# Altium project VISION_BETA_EBB.PrjPcb (part 6 of 9)

## Sheet 5V_REG.SchDoc
size A4; SheetNumber: 12; SheetTotal: 19
Used 2 times, as channels REG_0, REG_1. Parts and nets are listed once, with the designators drawn on the sheet.
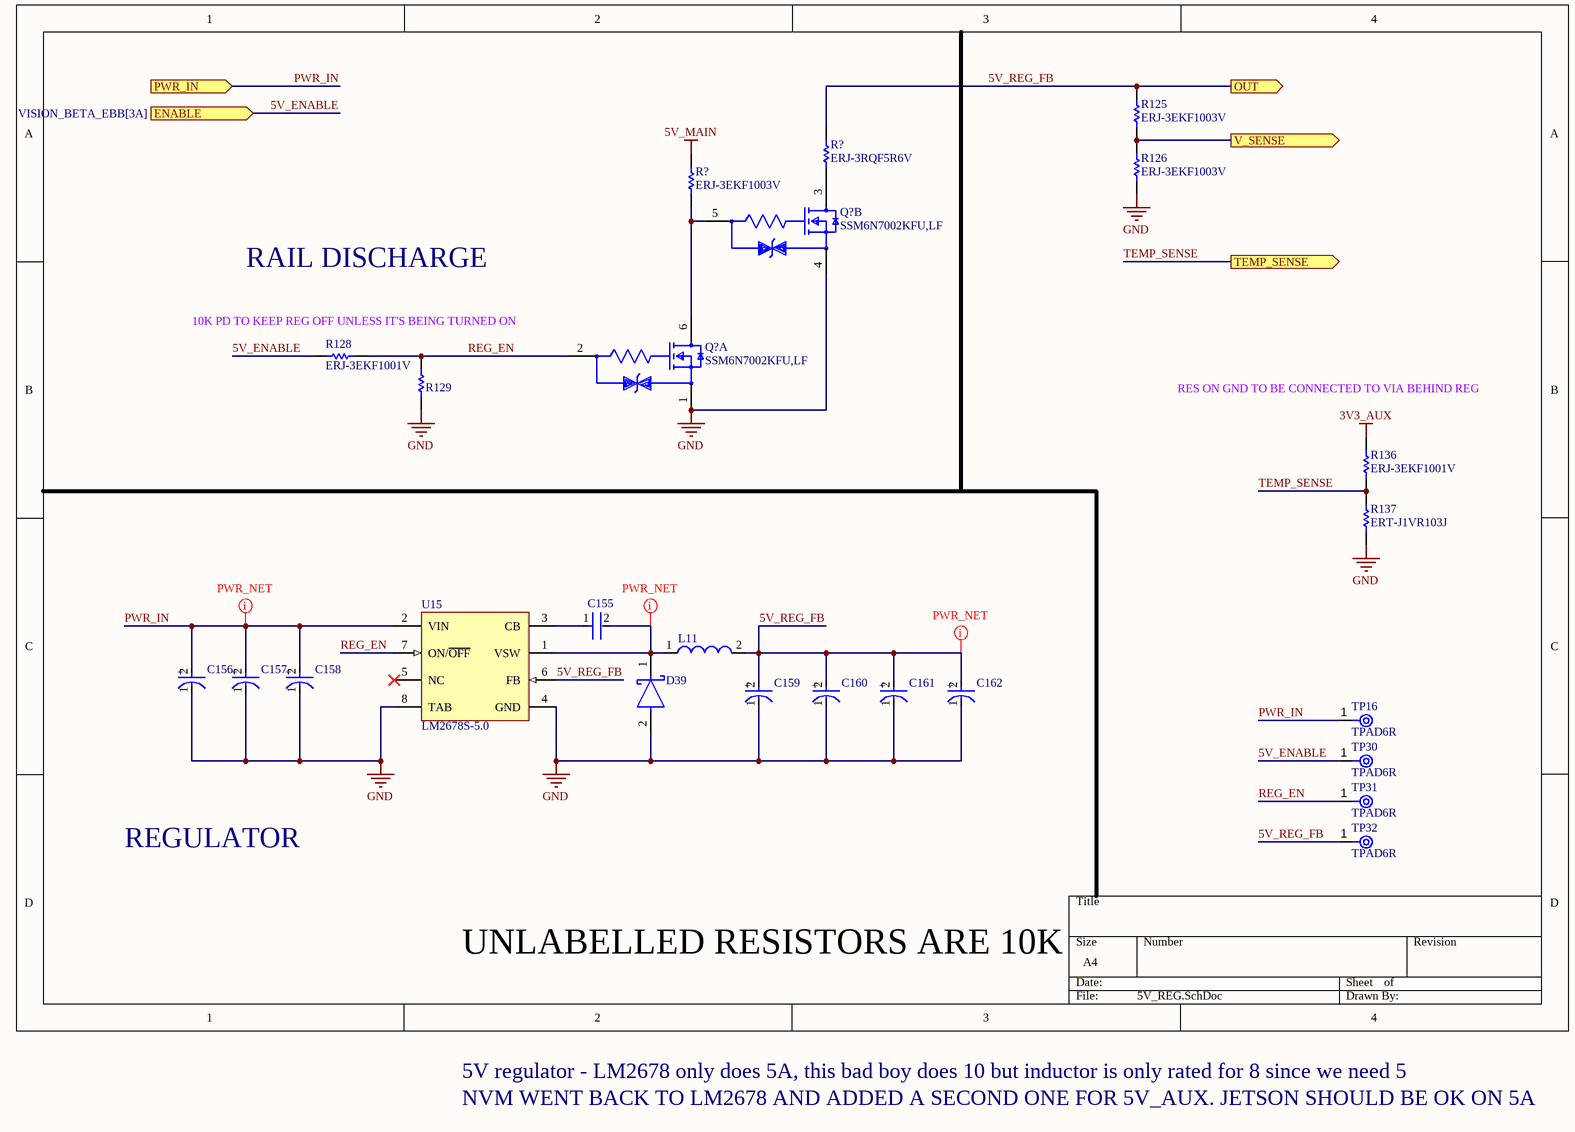
[diagram p30: 5V_REG.SchDoc]

### Parts
(Parts that share a designator on the sheet are numbered #1, #2 ... from top to bottom, then left to right.)
C155  C0805C103J5RACTU  [FP-C0805C-DN-MFG]  (value not drawn)
C156  20SVP33M  [FP-OS-CON-SMT-E7-MFG]  (value not drawn)
C157  20SVP33M  [FP-OS-CON-SMT-E7-MFG]  (value not drawn)
C158  20SVP33M  [FP-OS-CON-SMT-E7-MFG]  (value not drawn)
C159  EEE-1AA101WR  [FP-SC-MFG]  (value not drawn)
C160  EEE-1AA101WR  [FP-SC-MFG]  (value not drawn)
C161  EEE-1AA101WR  [FP-SC-MFG]  (value not drawn)
C162  EEE-1AA101WR  [FP-SC-MFG]  (value not drawn)
D39  B540C-13-F  [FP-SMC-MFG]  (value not drawn)
L11  74477110  [WE-PD-L]  (value not drawn)
Q?#1  SSM6N7002KFU,LF  [FP-SSOP6-P-0_65A-MFG]  (part B of 2)
Q?#2  SSM6N7002KFU,LF  [FP-SSOP6-P-0_65A-MFG]  (part A of 2)
R125  ERJ-3EKF1003V  [RESC1608X55X30ML15T15]
R126  ERJ-3EKF1003V  [RESC1608X55X30ML15T15]
R128  ERJ-3EKF1001V  [RESC1608X55X30LL15T15]
R129  ERJ3EKF1002V  [RESC1609X55X30LL15T15]  (value not drawn)
R136  ERJ-3EKF1001V  [RESC1608X55X30LL15T15]
R137  ERT-J1VR103J  [RESC1608X90X30ML15T20]
R?#1  ERJ-3RQF5R6V  [RESC1608X55X30LL15T15]
R?#2  ERJ-3EKF1003V  [RESC1608X55X30ML15T15]
TP16  TPAD6R  [New footprint 1]
TP30  TPAD6R  [New footprint 1]
TP31  TPAD6R  [New footprint 1]
TP32  TPAD6R  [New footprint 1]
U15  LM2678S-5.0  [KTW0007B_N]

### Ports
ENABLE (in, see VISION_BETA_EBB[3A]), OUT (out, see VISION_BETA_EBB[4A]), PWR_IN (in, see VISION_BETA_EBB[3A]), TEMP_SENSE (out, see VISION_BETA_EBB[4A]), V_SENSE (out, see VISION_BETA_EBB[4A])

### Nets
3V3_AUX: R136.2
5V_MAIN: R?#2.2
GND: C156.1(C) C157.1(C) C158.1(C) C159.1(C) C160.1(C) C161.1(C) C162.1(C) D39.2(A) Q?#1.4(Source2) Q?#2.1(Source1) R126.1 R129.1 R137.1 U15.4(GND) U15.8(TAB)
5V_ENABLE: R128.1 TP30.1(TP) ; port ENABLE
5V_REG_FB: C159.2(A) C160.2(A) C161.2(A) C162.2(A) L11.2 R125.2 R?#1.2 TP32.1(TP) U15.6(FB) ; port OUT
PWR_IN: C156.2(A) C157.2(A) C158.2(A) TP16.1(TP) U15.2(VIN) ; port PWR_IN
REG_EN: Q?#2.2(Gate1) R128.2 R129.2 TP31.1(TP) U15.7(ON/~{OFF})
TEMP_SENSE: R136.1 R137.2 ; port TEMP_SENSE
V_SENSE: R125.1 R126.2 ; port V_SENSE
NetC155_1: C155.1 U15.3(CB)
NetC155_2: C155.2 D39.1(C) L11.1 U15.1(VSW)
NetQ?#1_3: Q?#1.3(Drain2) R?#1.1
NetQ?#1_5: Q?#1.5(Gate2) Q?#2.6(Drain1) R?#2.1

Not connected (* = marked no-connect by the designer): U15 5(NC)*

### Channels
REG_0: designators C155=C155_REG_0 C156=C156_REG_0 C157=C157_REG_0 C158=C158_REG_0 C159=C159_REG_0 C160=C160_REG_0 C161=C161_REG_0 C162=C162_REG_0 D39=D39_REG_0 L11=L11_REG_0 Q?=Q?_REG_0#2 Q?=Q?_REG_0#1 R125=R125_REG_0 R126=R126_REG_0 R128=R128_REG_0 R129=R129_REG_0 R136=R136_REG_0 R137=R137_REG_0 R?=R?_REG_0#2 R?=R?_REG_0#1 TP16=TP16_REG_0 TP30=TP30_REG_0 TP31=TP31_REG_0 TP32=TP32_REG_0 U15=U15_REG_0; ports ENABLE=5V_ENABLE OUT=5V_REG_FB PWR_IN=5V_MAIN_VCC TEMP_SENSE=5V_MAIN_TEMP V_SENSE=5V_MAIN_V_SENSE
REG_1: designators C155=C155_REG_1 C156=C156_REG_1 C157=C157_REG_1 C158=C158_REG_1 C159=C159_REG_1 C160=C160_REG_1 C161=C161_REG_1 C162=C162_REG_1 D39=D39_REG_1 L11=L11_REG_1 Q?=Q?_REG_1#2 Q?=Q?_REG_1#1 R125=R125_REG_1 R126=R126_REG_1 R128=R128_REG_1 R129=R129_REG_1 R136=R136_REG_1 R137=R137_REG_1 R?=R?_REG_1#2 R?=R?_REG_1#1 TP16=TP16_REG_1 TP30=TP30_REG_1 TP31=TP31_REG_1 TP32=TP32_REG_1 U15=U15_REG_1; ports ENABLE=5V_AUX_ENABLE OUT=5V_REG_FB PWR_IN=INT_VCC TEMP_SENSE=5V_AUX_TEMP V_SENSE=5V_AUX_V_SENSE

### Layout directives
net class PWR: 5V_MAIN_VCC, 5V_REG_FB, NetC155_REG_0_2

### Notes on the sheet
- RAIL DISCHARGE
- 10K PD TO KEEP REG OFF UNLESS IT'S BEING TURNED ON
- RES ON GND TO BE CONNECTED TO VIA BEHIND REG
- REGULATOR
- UNLABELLED RESISTORS ARE 10K
- 5V regulator - LM2678 only does 5A, this bad boy does 10 but inductor is only rated for 8 since we need 5
- NVM WENT BACK TO LM2678 AND ADDED A SECOND ONE FOR 5V_AUX. JETSON SHOULD BE OK ON 5A
- (in symbol CMP-05427-000047-1) +
- (in symbol CMP-05428-001387-1) +

### Library data of the parts
C155 = CMP-2007-00254-2: CAP CER 10000PF 50V X7R 0805; Manufacturer: KEMET; Value: 10,000 pF; Material: Ceramic; Temperature Coefficient: 30ppm/°C; Tolerance: 0.05; Device Class L1: Passive Components; Temperature: -55°C to +125°C; Lead Free: Yes; ComponentLink2URL: https://content.kemet.com/datasheets/KEM_C1003_C0G_SMD.pdf; Device Class L3: Ceramic Capacitors; Temperature Characteristic: X7R; Temperature Range High: +125°C; Mouser Description: Capacitor; Ceramic; Cap 0.01uF; Tol 5%; Vol-Rtg 50 V; SMT; Case 0805; X7R; TR; ComponentLink2Description: Datasheet; Manufacturer Part Number: C0805C103J5RACTU; Height: 0.88mm; Digikey Description: CAP CER 10000PF 50V X7R 0805; Capacitance: 10,000 pF; Temperature Range Low: -55°C; Device Class L2: Capacitors; Octopart: https://octopart.com/c0805c103j5ractu-kemet-133473; Voltage Rating: 50 V; Category: Cap; RoHS: TRUE; Automotive: No; Package: C0805C-DN; Ipc Land Pattern Name: CAPC200125X78
C156-C158 = CMP-05428-001387-1: Conductive Polymer Aluminum Solid Capacitors (OS-CON) 33uF ±20% 20V RADIAL SMT 8x6.9mm; Polarity: Polar; Life (Hours): 2000Hour; Leakage Current: 132uA; ESR (Equivalent Series Resistance): 45mR; Ripple Current (AC): 1.89A; Dissipation Factor: 12%; Construction: Cylindrical; Capacitance: 33uF; Max Operating Temperature: 105°C; Min Operating Temperature: -55°C; Voltage: 20V; Number of Pins: 7; Termination: SMD/SMT; Package Quantity: 1000; Packaging: Tape and Reel; REACH SVHC: No SVHC; Mount: Surface Mount; Tolerance: 20%; Voltage Rating (DC): 20V; Height: 6.9mm; Series: OS-CON™, SVP; Diameter: 8mm; Length: 6.9mm; Ripple Current: 1.89A; RoHS Compliant: Yes; Height - Seated (Max): 0.276inch; Case/Package: Radial; Voltage Rating: 20V
C159-C162 = CMP-05427-000047-1: CAP ALUM 100UF 20% 10V SMD; Life (Hours): 1000Hour; Ripple Current: 50mA; Packaging: Tape and Reel; Diameter: 5mm; Voltage Rating (DC): 10V; Mount: Surface Mount; Max Operating Temperature: 85°C; Length: 5.5mm; Case/Package: Radial; Height: 5.4mm; Construction: Cylindrical; Termination: SMD/SMT; Height - Seated (Max): 0.213inch; Series: S; Min Operating Temperature: -40°C; Capacitance: 100uF; Tolerance: 20%; Voltage Rating: 10V; Package Quantity: 1; Radiation Hardening: No; Ripple Current (AC): 50mA; Lead Free: Lead Free; RoHS Compliant: Yes; Contact Plating: Tin
D39 = CMP-2000-05097-3: DIODE SCHOTTKY 40V 5A SMC; Manufacturer: Diodes Inc.; Automotive Grade: NA; Peak Reverse Current: 0.5mA; Value: 300pF; Max Junction Temp: +150°C; Max Surge Forward Current: 100A; Standoff Height: 0.1mm; Digikey Description: DIODE SCHOTTKY 40V 5A SMC; Temperature Range Low: -55°C; Manufacturer Part Number: B540C-13-F; Octopart: https://octopart.com/b540c-13-f-diodes+inc.-325873; Lead Free: Yes; Reverse Voltage: 40V; RoHS: TRUE; Category: Diode; Mouser Description: Diode: Schottky rectifying; SMD; 40V; 5A; SMC; Package: reel, tape; ComponentLink2Description: Datasheet; Temperature Range High: +150°C; Automotive: No; Footprint Url: https://www.diodes.com/assets/Package-Files/SMC.pdf; Device Class L3: Schottky Diodes; Height: 2.5mm; Forward Current: 5A; Temperature: -55°C to +150°C; Package: SMC; ComponentLink2URL: https://www.diodes.com/assets/Datasheets/ds13012.pdf; Device Class L2: Diodes; Max Repetitive Reverse Voltage: 40V; Device Class L1: Discrete Semiconductors; Capacitance: 300pF
L11 = CMP-0227-00708-1: SMD-Shielded Power Inductor WE-PD, L = 10.0 µH; Inductance: 10.0 ÂµH; ComponentLink2Description: Datasheet; DatasheetVersion: ver 7, Sep-2006; PackageVersion: 2006; ComponentLink1URL: http://www.we-online.com; ComponentLink1Description: Manufacturer Link; ComponentLink2URL: http://www.we-online.de/katalog/media/pdf/74477110.pdf; PackageDescription: SMD Inductor, 2-Leads, Body 12.0 x 12.0 mm; PackageReference: WE-PD-L
Q?#1 Q?#2 = CMP-35916-000009-1: MOSFET 2N-CH 60V 0.3A; Input Capacitance: 40pF; Continuous Drain Current (ID): 300mA; Max Power Dissipation: 285mW; FET Type: 2 N-Channel; Rds On Max: 1.5R; Mount: Surface Mount; Drain to Source Voltage (Vdss): 60V; Packaging: Tape and Reel
R125 R126 R?#2 = CMP-2000-00182-1: Manufacturer: Panasonic; Part Number: ERJ-3EKF1003V
R128 R136 = CMP-2000-00180-1: Manufacturer: Panasonic; Part Number: ERJ-3EKF1001V
R129 = CMP-1012-00623-3: Chip Resistor, 10 KOhm, +/- 1%, 0.1 W, -55 to 155 degC, 0603 (1608 Metric), RoHS, Tape and Reel; Manufacturer: Panasonic; Voltage Rating: 75V; Case\/Package: 0603; Power Rating: 100mW; Resistance: 10KOhm; Temperature Coefficient: 100ppm\/degreesC; Number of Pins: 2; Package Reference: 603; Depth: 0.8mm; Mount: SurfaceMount; Package Description: 2-Pin Surface Mount Device, Body 1.6 x 0.85 mm; Datasheet Version: 02/2017; Length: 1.6mm; Lead Free: LeadFree; Height: 0.45mm; Number of Terminations: 2; Max Power Dissipation: 100mW; Min Operating Temperature: -55degC; Datasheet URL: https://industrial.panasonic.com/cdbs/www-data/pdf/RDA0000/AOA0000C304.pdf; Termination: SMD/SMT; Case Code (Metric): 1608; Case Code (Imperial): 0603; Tolerance: 1%; Max Operating Temperature: 155degC; RoHSCompliant: true; Voltage Rating (DC): 75V; Radiation Hardening: No; Packaging: TapeandReel; Composition: ThickFilm; Mounting Technology: SurfaceMount; Manufacturer URL: http://www.panasonic.com/; Width: 0.031inch; REACH SVHC: NoSVHC; Contact Plating: Tin; Military Standard: Not; Package Quantity: 1
R137 = CMP-2000-00869-1: Manufacturer: Panasonic; Part Number: ERT-J1VR103J
R?#1 = CMP-2000-00850-1: Manufacturer: Panasonic; Part Number: ERJ-3RQF5R6V
TP16 TP30-TP32 = CMP-00025-2: Test Point .6mm
U15 = CMP-0069-00190-3: SIMPLE SWITCHER® High Efficiency 5A Step-Down Voltage Regulator, 7-pin TO-263; Manufacturer: Texas Instruments; PowerWise: N; PackageTopMarking: NSUZXYTTE#*LM2678*S-5.0; RoHS: N; PinCount: 7; Code_JEDEC: MO-169-AC; ComponentLink1URL: http://www.ti.com/general/docs/lit/getliterature.tsp?genericPartNumber=LM2678&fileType=pdf; ComponentLink1Description: Datasheet URL; PackageReference: KTW0007B; PackageDescription: TO-263, Molded, .400 x .390 x .180in Body, 7 Lead, .050in Pitch, Surface Mount; CompType: Switcher

## Sheet 2V_REG.SchDoc
size A4; SheetNumber: 10; SheetTotal: 19
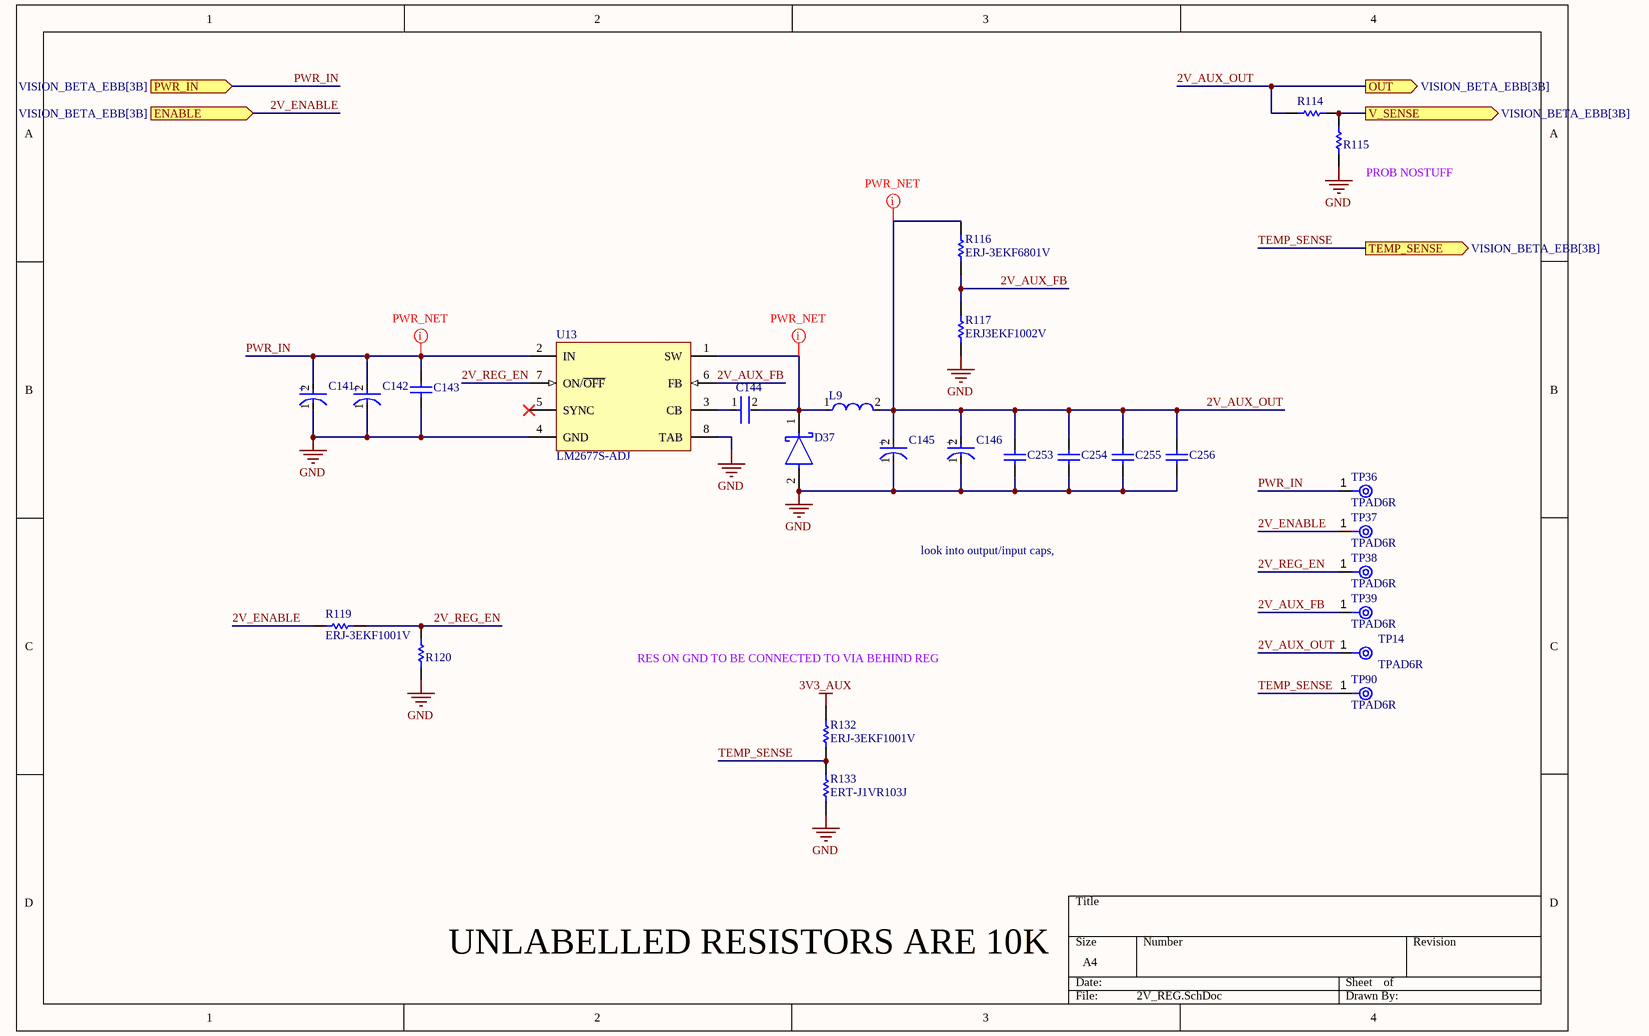
[diagram p31: 2V_REG.SchDoc]

### Parts
C141  EEHZA1V680XP  [FP-EEH-D8-MFG]  (value not drawn)
C142  EEHZA1V680XP  [FP-EEH-D8-MFG]  (value not drawn)
C143  CAP 470nF 50V 1812(4532)  [CAPC1812(4532)125_M]  (value not drawn)
C144  C0805C103J5RACTU  [FP-C0805C-DN-MFG]  (value not drawn)
C145  16SVPC120M  [FP-OS-CON-SMT-E7-MFG]  (value not drawn)
C146  16SVPC120M  [FP-OS-CON-SMT-E7-MFG]  (value not drawn)
C253  CAP 470nF 50V 1812(4532)  [CAPC1812(4532)125_M]  (value not drawn)
C254  CAP 470nF 50V 1812(4532)  [CAPC1812(4532)125_M]  (value not drawn)
C255  CAP 470nF 50V 1812(4532)  [CAPC1812(4532)125_M]  (value not drawn)
C256  CAP 470nF 50V 1812(4532)  [CAPC1812(4532)125_M]  (value not drawn)
D37  B540C-13-F  [FP-SMC-MFG]  (value not drawn)
L9  SRR1260-150M  [FP-SRR1260-MFG]  (value not drawn)
R114  ERJ3EKF1002V  [RESC1609X55X30LL15T15]  (value not drawn)
R115  ERJ3EKF1002V  [RESC1609X55X30LL15T15]  (value not drawn)
R116  ERJ-3EKF6801V  [RESC1609X55X30NL15T15]
R117  ERJ3EKF1002V  [RESC1609X55X30LL15T15]
R119  ERJ-3EKF1001V  [RESC1608X55X30LL15T15]
R120  ERJ3EKF1002V  [RESC1609X55X30LL15T15]  (value not drawn)
R132  ERJ-3EKF1001V  [RESC1608X55X30LL15T15]
R133  ERT-J1VR103J  [RESC1608X90X30ML15T20]
TP14  TPAD6R  [New footprint 1]
TP36  TPAD6R  [New footprint 1]
TP37  TPAD6R  [New footprint 1]
TP38  TPAD6R  [New footprint 1]
TP39  TPAD6R  [New footprint 1]
TP90  TPAD6R  [New footprint 1]
U13  LM2677S-ADJ  [KTW0007B_M]

### Ports
ENABLE (in, see VISION_BETA_EBB[3B]), OUT (out, see VISION_BETA_EBB[3B]), PWR_IN (in, see VISION_BETA_EBB[3B]), TEMP_SENSE (out, see VISION_BETA_EBB[3B]), V_SENSE (out, see VISION_BETA_EBB[3B])

### Nets
2V_AUX_OUT: C145.2(A) C146.2(A) C253.2 C254.2 C255.2 C256.2 L9.2 R114.1 R116.2 TP14.1(TP) ; port OUT
3V3_AUX: R132.2  [project net 3V3_AUX_FB]
GND: C141.1(C) C142.1(C) C143.1 C145.1(C) C146.1(C) C253.1 C254.1 C255.1 C256.1 D37.2(A) R115.1 R117.1 R120.1 R133.1 U13.4(GND) U13.8(TAB)
2V_AUX_FB: R116.1 R117.2 TP39.1(TP) U13.6(FB)
2V_AUX_V_SENSE: R114.2 R115.2 ; port V_SENSE
2V_ENABLE: R119.1 TP37.1(TP) ; port ENABLE  [project net 2V_AUX_ENABLE]
2V_REG_EN: R119.2 R120.2 TP38.1(TP) U13.7(ON/~{OFF})
PWR_IN: C141.2(A) C142.2(A) C143.2 TP36.1(TP) U13.2(IN) ; port PWR_IN  [project net 2V_AUX_VCC]
TEMP_SENSE: R132.1 R133.2 TP90.1(TP) ; port TEMP_SENSE  [project net 2V_AUX_TEMP]
NetC144_1: C144.1 U13.3(CB)
NetC144_2: C144.2 D37.1(C) L9.1 U13.1(SW)

Not connected (* = marked no-connect by the designer): U13 5(SYNC)*

### Layout directives
net class PWR: 2V_AUX_OUT, 2V_AUX_VCC, NetC144_2

### Notes on the sheet
- (near R115) PROB NOSTUFF
- look into output/input caps,
- RES ON GND TO BE CONNECTED TO VIA BEHIND REG
- UNLABELLED RESISTORS ARE 10K
- (in symbol CMP-05428-000021-2) +
- (in symbol CMP-05428-001211-1) +

### Library data of the parts
C141 C142 = CMP-05428-001211-1: Conductive Polymer Hybrid Aluminum Electrolytic Capacitors 68uF ±20% 35V RADIAL SMT 6.3x7.7mm; Leakage Current: 23.8uA; Ripple Current (AC): 2A; Polarity: Polar; Life (Hours): 5000Hour; ESR (Equivalent Series Resistance): 35mR; Lead Diameter: 0.65mm; Termination: SMD/SMT; Case/Package: Radial; Package Quantity: 900; Radiation Hardening: No; Max Operating Temperature: 105°C; Capacitance: 68uF; Voltage Rating: 35V; Number of Pins: 8; Mount: Surface Mount; Technology: HYBRID; Diameter: 6.3mm; Min Operating Temperature: -55°C; Length: 7.7mm; Ratings: AEC-Q200; Height - Seated (Max): 0.315inch; Ripple Current: 2A; Lead Free: Lead Free; Voltage: 35V; Lead Pitch: 1.8mm; Voltage Rating (DC): 35V; REACH SVHC: No SVHC; Material: Polymer; Height: 7.7mm; Tolerance: 20%; Construction: Cylindrical; Packaging: Tape and Reel; Series: ZA
C143 C253-C256 = CMP-1040-01539-1: CAP 470nF 50V ±10% 1812 (4532 Metric) Thickness 1.25mm SMD; Tolerance: Â±10%; Case-Metric: 4532; Case-EIA: 1812; Technology: SMT; Max Thickness: 1.25 mm; Value: 470nF; Rated Voltage: 50 V
C144 = CMP-2007-00254-2: as C155 on sheet 5V_REG; Device Class L1: Passive Components; Temperature: -55°C to +125°C; Lead Free: Yes; ComponentLink2URL: https://content.kemet.com/datasheets/KEM_C1003_C0G_SMD.pdf; Device Class L3: Ceramic Capacitors; Temperature Characteristic: X7R; Temperature Range High: +125°C; Mouser Description: Capacitor; Ceramic; Cap 0.01uF; Tol 5%; Vol-Rtg 50 V; SMT; Case 0805; X7R; TR; ComponentLink2Description: Datasheet; Manufacturer Part Number: C0805C103J5RACTU; Height: 0.88mm; Digikey Description: CAP CER 10000PF 50V X7R 0805; Capacitance: 10,000 pF; Temperature Range Low: -55°C; Device Class L2: Capacitors; Octopart: https://octopart.com/c0805c103j5ractu-kemet-133473; Voltage Rating: 50 V; Category: Cap; RoHS: TRUE; Automotive: No; Package: C0805C-DN; Ipc Land Pattern Name: CAPC200125X78
C145 C146 = CMP-05428-000021-2: Conductive Polymer Aluminum Solid Capacitors (OS-CON) 120uF ±20% 16V RADIAL SMT 8x6.9mm; Leakage Current: 500uA; Ripple Current: 2.9A; ESR (Equivalent Series Resistance): 27mR; Polarity: Polar; Dissipation Factor: 12%; Life (Hours): 2000Hour; Lead Free: Lead Free; Voltage Rating (DC): 16V; Min Operating Temperature: -55°C; Height - Seated (Max): 0.276inch; Case/Package: Radial; REACH SVHC: No SVHC; Diameter: 8mm; Mount: Surface Mount; Package Quantity: 1000; Construction: Cylindrical; Max Operating Temperature: 105°C; Capacitance: 120uF; Voltage: 16V; Length: 6.9mm; Tolerance: 20%; RoHS Compliant: Yes; Series: OS-CON, SVPC; Packaging: Tape and Reel; Voltage Rating: 16V; Termination: SMD/SMT; Number of Pins: 7; Ripple Current (AC): 2.9A; Height: 6.9mm
D37 = CMP-2000-05097-3: as D39 on sheet 5V_REG; Digikey Description: DIODE SCHOTTKY 40V 5A SMC; Temperature Range Low: -55°C; Manufacturer Part Number: B540C-13-F; Octopart: https://octopart.com/b540c-13-f-diodes+inc.-325873; Lead Free: Yes; Reverse Voltage: 40V; RoHS: TRUE; Category: Diode; Mouser Description: Diode: Schottky rectifying; SMD; 40V; 5A; SMC; Package: reel, tape; ComponentLink2Description: Datasheet; Temperature Range High: +150°C; Automotive: No; Footprint Url: https://www.diodes.com/assets/Package-Files/SMC.pdf; Device Class L3: Schottky Diodes; Height: 2.5mm; Forward Current: 5A; Temperature: -55°C to +150°C; Package: SMC; ComponentLink2URL: https://www.diodes.com/assets/Datasheets/ds13012.pdf; Device Class L2: Diodes; Max Repetitive Reverse Voltage: 40V; Device Class L1: Discrete Semiconductors; Capacitance: 300pF
L9 = CMP-2000-07146-2: FIXED IND 15UH 5A 27 MOHM SMD; Q Factor: 25; Sample Rate (Hz): 100kHz; Resistance: 27MR; Material: Steel; Inductance Tolerance: 20%; Frequency: 17.6MHz; Saturation Current: 4.6A; Core Material: Ferrite; Shielding: Shielded; Series: SRR1260; Termination: SMD/SMT; Packaging: Tape and Reel; RoHS Compliant: Yes; Height - Seated (Max): 0.256inch; Depth: 12.8mm; Case/Package: 1260; Inductance: 15uH; Height: 6mm; Number of Pins: 2; Mount: Surface Mount; Min Operating Temperature: -40°C; Test Frequency: 100kHz; Length: 12.5mm; Self Resonant Frequency: 17.6MHz; Current Rating: 5A; Tolerance: 20%; RMS Current (Irms): 5A; REACH SVHC: No SVHC; Resistor Type: Wirewound; DC Resistance (DCR): 27mR; Width: 12.5mm; Package Quantity: 600; DC Current: 5A; Max DC Current: 5A; Max Operating Temperature: 125°C; Military Standard: Not
R114 R115 R117 R120 = CMP-1012-00623-3: as R129 on sheet 5V_REG; Number of Pins: 2; Package Reference: 603; Depth: 0.8mm; Mount: SurfaceMount; Package Description: 2-Pin Surface Mount Device, Body 1.6 x 0.85 mm; Datasheet Version: 02/2017; Length: 1.6mm; Lead Free: LeadFree; Height: 0.45mm; Number of Terminations: 2; Max Power Dissipation: 100mW; Min Operating Temperature: -55degC; Datasheet URL: https://industrial.panasonic.com/cdbs/www-data/pdf/RDA0000/AOA0000C304.pdf; Termination: SMD/SMT; Case Code (Metric): 1608; Case Code (Imperial): 0603; Tolerance: 1%; Max Operating Temperature: 155degC; RoHSCompliant: true; Voltage Rating (DC): 75V; Radiation Hardening: No; Packaging: TapeandReel; Composition: ThickFilm; Mounting Technology: SurfaceMount; Manufacturer URL: http://www.panasonic.com/; Width: 0.031inch; REACH SVHC: NoSVHC; Contact Plating: Tin; Military Standard: Not; Package Quantity: 1
R116 = CMP-1012-00604-3: Chip Resistor, 6.8 KOhm, +/- 1%, 0.1 W, -55 to 155 degC, 0603 (1608 Metric), RoHS, Tape and Reel; Frequency: 48 MHz; Min Supply Voltage: 1.71 V; I\Os: 50; Max Supply Voltage: 3.6 V; Interface: UART; Density: 128 KB; RAM Size: 16 KB; PWM Channels: 6; ADC Channels: 14; Case\Package: LQFP; PackageDescription: 2-Pin Surface Mount Device, Body 1.6 x 0.85 mm; Max Operating Temperature: 105 degC; Package Quantity: 160; ComponentLink2Description: Datasheet; Max Clock Frequency: 48 MHz; ComponentLink1URL: http://www.panasonic.com/; REACH SVHC: No SVHC; Min Operating Temperature: -40 degC; Weight: 0.012224 oz; ComponentLink2URL: http://industrial.panasonic.com/cdbs/www-data/pdf/RDA0000/AOA0000C86.pdf; ComponentLink1Description: Manufacturer URL; Pins: 64; DatasheetVersion: Apr-15; RoHSCompliant: true; PackageReference: 0603; Packaging: Tray; Length: 10 mm; Radiation Hardening: No; Mount: Surface Mount; Width: 10 mm; Height: 1.45 mm
R119 R132 = CMP-2000-00180-1: Manufacturer: Panasonic; Part Number: ERJ-3EKF1001V
R133 = CMP-2000-00869-1: Manufacturer: Panasonic; Part Number: ERT-J1VR103J
TP14 TP36-TP39 TP90 = CMP-00025-2: Test Point .6mm
U13 = CMP-0069-00211-3: SIMPLE SWITCHER® High Efficiency 5A Step-Down Voltage Regulator with Sync, 7-pin TO-263; Manufacturer: Texas Instruments; PackageTopMarking: NSUZXYTTE#*LM2677S*-ADJ; PowerWise: N; PinCount: 7; CompType: Switcher; ComponentLink1Description: Datasheet URL; PackageReference: KTW0007B; Code_JEDEC: MO-169-AC; ComponentLink1URL: http://www.ti.com/general/docs/lit/getliterature.tsp?genericPartNumber=LM2677&fileType=pdf; PackageDescription: TO-263, Molded, .400 x .390 x .180in Body, 7 Lead, .050in Pitch, Surface Mount; RoHS: N

## Sheet 3V3_REG.SchDoc
size A4; SheetNumber: 11; SheetTotal: 18
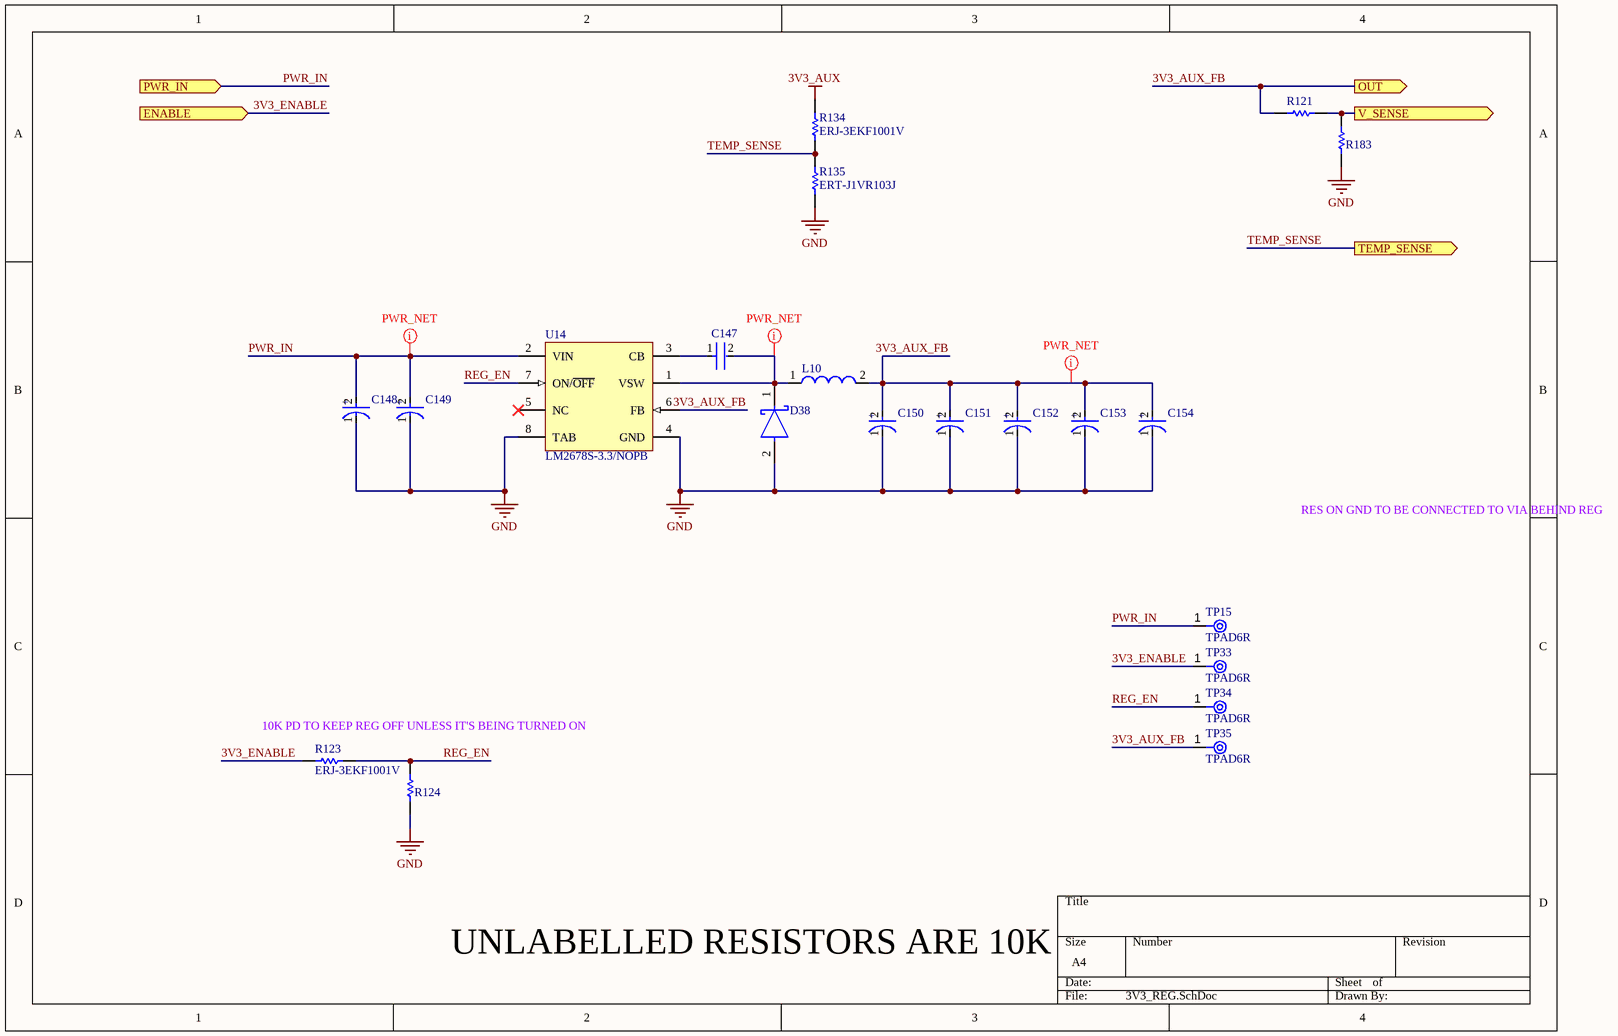
[diagram p32: 3V3_REG.SchDoc]

### Parts
C147  C0805C103J5RACTU  [FP-C0805C-DN-MFG]  (value not drawn)
C148  EEHZA1V680XP  [FP-EEH-D8-MFG]  (value not drawn)
C149  EEHZA1V680XP  [FP-EEH-D8-MFG]  (value not drawn)
C150  16SVPC120M  [FP-OS-CON-SMT-E7-MFG]  (value not drawn)
C151  16SVPC120M  [FP-OS-CON-SMT-E7-MFG]  (value not drawn)
C152  16SVPC120M  [FP-OS-CON-SMT-E7-MFG]  (value not drawn)
C153  16SVPC120M  [FP-OS-CON-SMT-E7-MFG]  (value not drawn)
C154  16SVPC120M  [FP-OS-CON-SMT-E7-MFG]  (value not drawn)
D38  B540C-13-F  [FP-SMC-MFG]  (value not drawn)
L10  74477110  [WE-PD-L]  (value not drawn)
R121  ERJ3EKF1002V  [RESC1609X55X30LL15T15]  (value not drawn)
R123  ERJ-3EKF1001V  [RESC1608X55X30LL15T15]
R124  ERJ3EKF1002V  [RESC1609X55X30LL15T15]  (value not drawn)
R134  ERJ-3EKF1001V  [RESC1608X55X30LL15T15]
R135  ERT-J1VR103J  [RESC1608X90X30ML15T20]
R183  ERJ3EKF1002V  [RESC1609X55X30LL15T15]  (value not drawn)
TP15  TPAD6R  [New footprint 1]
TP33  TPAD6R  [New footprint 1]
TP34  TPAD6R  [New footprint 1]
TP35  TPAD6R  [New footprint 1]
U14  LM2678S-3.3/NOPB  [KTW0007B_N]

### Ports
ENABLE (in), OUT (out, see VISION_BETA_EBB[4A]), PWR_IN (in, see VISION_BETA_EBB[3A]), TEMP_SENSE (out, see VISION_BETA_EBB[4A]), V_SENSE (out, see VISION_BETA_EBB[4A])

### Nets
3V3_AUX_FB: C150.2(A) C151.2(A) C152.2(A) C153.2(A) C154.2(A) L10.2 R121.1 R134.2 TP35.1(TP) U14.6(FB) ; port OUT  [also labelled 3V3_AUX]
GND: C148.1(C) C149.1(C) C150.1(C) C151.1(C) C152.1(C) C153.1(C) C154.1(C) D38.2(A) R124.1 R135.1 R183.1 U14.4(GND) U14.8(TAB)
3V3_AUX_V_SENSE: R121.2 R183.2 ; port V_SENSE
3V3_ENABLE: R123.1 TP33.1(TP) ; port ENABLE  [project net 3V3_AUX_ENABLE]
PWR_IN: C148.2(A) C149.2(A) TP15.1(TP) U14.2(VIN) ; port PWR_IN  [project net 3V3_AUX_VCC]
REG_EN: R123.2 R124.2 TP34.1(TP) U14.7(ON/~{OFF})
TEMP_SENSE: R134.1 R135.2 ; port TEMP_SENSE  [project net 3V3_AUX_TEMP]
NetC147_1: C147.1 U14.3(CB)
NetC147_2: C147.2 D38.1(C) L10.1 U14.1(VSW)

Not connected (* = marked no-connect by the designer): U14 5(NC)*

### Layout directives
net class PWR: 3V3_AUX_FB, 3V3_AUX_VCC, NetC147_2

### Notes on the sheet
- RES ON GND TO BE CONNECTED TO VIA BEHIND REG
- 10K PD TO KEEP REG OFF UNLESS IT'S BEING TURNED ON
- UNLABELLED RESISTORS ARE 10K
- (in symbol CMP-05428-000021-2) +
- (in symbol CMP-05428-001211-1) +

### Library data of the parts
C147 = CMP-2007-00254-2: as C155 on sheet 5V_REG; Device Class L1: Passive Components; Temperature: -55°C to +125°C; Lead Free: Yes; ComponentLink2URL: https://content.kemet.com/datasheets/KEM_C1003_C0G_SMD.pdf; Device Class L3: Ceramic Capacitors; Temperature Characteristic: X7R; Temperature Range High: +125°C; Mouser Description: Capacitor; Ceramic; Cap 0.01uF; Tol 5%; Vol-Rtg 50 V; SMT; Case 0805; X7R; TR; ComponentLink2Description: Datasheet; Manufacturer Part Number: C0805C103J5RACTU; Height: 0.88mm; Digikey Description: CAP CER 10000PF 50V X7R 0805; Capacitance: 10,000 pF; Temperature Range Low: -55°C; Device Class L2: Capacitors; Octopart: https://octopart.com/c0805c103j5ractu-kemet-133473; Voltage Rating: 50 V; Category: Cap; RoHS: TRUE; Automotive: No; Package: C0805C-DN; Ipc Land Pattern Name: CAPC200125X78
C148 C149 = CMP-05428-001211-1: as C141 on sheet 2V_REG; Termination: SMD/SMT; Case/Package: Radial; Package Quantity: 900; Radiation Hardening: No; Max Operating Temperature: 105°C; Capacitance: 68uF; Voltage Rating: 35V; Number of Pins: 8; Mount: Surface Mount; Technology: HYBRID; Diameter: 6.3mm; Min Operating Temperature: -55°C; Length: 7.7mm; Ratings: AEC-Q200; Height - Seated (Max): 0.315inch; Ripple Current: 2A; Lead Free: Lead Free; Voltage: 35V; Lead Pitch: 1.8mm; Voltage Rating (DC): 35V; REACH SVHC: No SVHC; Material: Polymer; Height: 7.7mm; Tolerance: 20%; Construction: Cylindrical; Packaging: Tape and Reel; Series: ZA
C150-C154 = CMP-05428-000021-2: as C145 on sheet 2V_REG; Lead Free: Lead Free; Voltage Rating (DC): 16V; Min Operating Temperature: -55°C; Height - Seated (Max): 0.276inch; Case/Package: Radial; REACH SVHC: No SVHC; Diameter: 8mm; Mount: Surface Mount; Package Quantity: 1000; Construction: Cylindrical; Max Operating Temperature: 105°C; Capacitance: 120uF; Voltage: 16V; Length: 6.9mm; Tolerance: 20%; RoHS Compliant: Yes; Series: OS-CON, SVPC; Packaging: Tape and Reel; Voltage Rating: 16V; Termination: SMD/SMT; Number of Pins: 7; Ripple Current (AC): 2.9A; Height: 6.9mm
D38 = CMP-2000-05097-3: as D39 on sheet 5V_REG; Digikey Description: DIODE SCHOTTKY 40V 5A SMC; Temperature Range Low: -55°C; Manufacturer Part Number: B540C-13-F; Octopart: https://octopart.com/b540c-13-f-diodes+inc.-325873; Lead Free: Yes; Reverse Voltage: 40V; RoHS: TRUE; Category: Diode; Mouser Description: Diode: Schottky rectifying; SMD; 40V; 5A; SMC; Package: reel, tape; ComponentLink2Description: Datasheet; Temperature Range High: +150°C; Automotive: No; Footprint Url: https://www.diodes.com/assets/Package-Files/SMC.pdf; Device Class L3: Schottky Diodes; Height: 2.5mm; Forward Current: 5A; Temperature: -55°C to +150°C; Package: SMC; ComponentLink2URL: https://www.diodes.com/assets/Datasheets/ds13012.pdf; Device Class L2: Diodes; Max Repetitive Reverse Voltage: 40V; Device Class L1: Discrete Semiconductors; Capacitance: 300pF
L10 = CMP-0227-00708-1: as L11 on sheet 5V_REG; ComponentLink2Description: Datasheet; DatasheetVersion: ver 7, Sep-2006; PackageVersion: 2006; ComponentLink1URL: http://www.we-online.com; ComponentLink1Description: Manufacturer Link; ComponentLink2URL: http://www.we-online.de/katalog/media/pdf/74477110.pdf; PackageDescription: SMD Inductor, 2-Leads, Body 12.0 x 12.0 mm; PackageReference: WE-PD-L
R121 R124 R183 = CMP-1012-00623-3: as R129 on sheet 5V_REG; Number of Pins: 2; Package Reference: 603; Depth: 0.8mm; Mount: SurfaceMount; Package Description: 2-Pin Surface Mount Device, Body 1.6 x 0.85 mm; Datasheet Version: 02/2017; Length: 1.6mm; Lead Free: LeadFree; Height: 0.45mm; Number of Terminations: 2; Max Power Dissipation: 100mW; Min Operating Temperature: -55degC; Datasheet URL: https://industrial.panasonic.com/cdbs/www-data/pdf/RDA0000/AOA0000C304.pdf; Termination: SMD/SMT; Case Code (Metric): 1608; Case Code (Imperial): 0603; Tolerance: 1%; Max Operating Temperature: 155degC; RoHSCompliant: true; Voltage Rating (DC): 75V; Radiation Hardening: No; Packaging: TapeandReel; Composition: ThickFilm; Mounting Technology: SurfaceMount; Manufacturer URL: http://www.panasonic.com/; Width: 0.031inch; REACH SVHC: NoSVHC; Contact Plating: Tin; Military Standard: Not; Package Quantity: 1
R123 R134 = CMP-2000-00180-1: Manufacturer: Panasonic; Part Number: ERJ-3EKF1001V
R135 = CMP-2000-00869-1: Manufacturer: Panasonic; Part Number: ERT-J1VR103J
TP15 TP33-TP35 = CMP-00025-2: Test Point .6mm
U14 = CMP-0069-00195-3: SIMPLE SWITCHER® High Efficiency 5A Step-Down Voltage Regulator, 7-pin TO-263, Pb-Free; Manufacturer: Texas Instruments; PackageTopMarking: NSUZXYTTE#*LM2678*S-3.3; PowerWise: N; PackageReference: KTW0007B; Code_JEDEC: MO-169-AC; CompType: Switcher; RoHS: Y; PackageDescription: TO-263, Molded, .400 x .390 x .180in Body, 7 Lead, .050in Pitch, Surface Mount; ComponentLink1Description: Datasheet URL; PinCount: 7; ComponentLink1URL: http://www.ti.com/general/docs/lit/getliterature.tsp?genericPartNumber=LM2678&fileType=pdf

## Sheet ADC.SchDoc
size A4; SheetNumber: 13; SheetTotal: 20
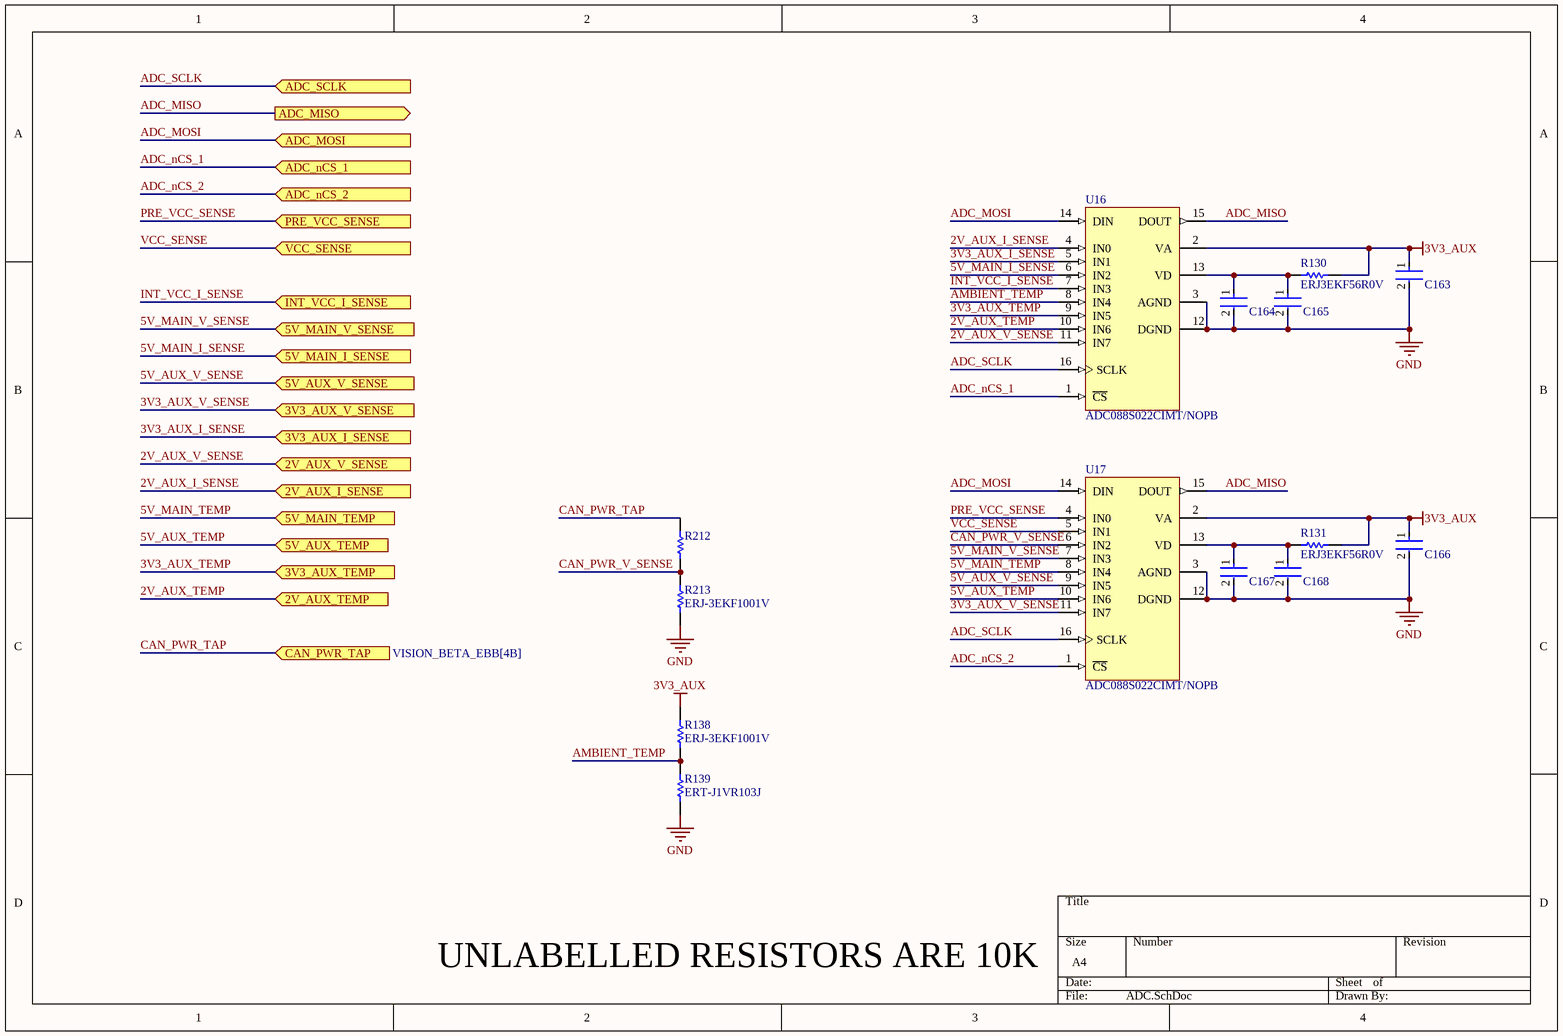
[diagram p33: ADC.SchDoc]

### Parts
C163  C0402C104K8PACTU  [FP-C0402-BB-MFG]  (value not drawn)
C164  C0402C104K8PACTU  [FP-C0402-BB-MFG]  (value not drawn)
C165  C0402C104K8PACTU  [FP-C0402-BB-MFG]  (value not drawn)
C166  C0402C104K8PACTU  [FP-C0402-BB-MFG]  (value not drawn)
C167  C0402C104K8PACTU  [FP-C0402-BB-MFG]  (value not drawn)
C168  C0402C104K8PACTU  [FP-C0402-BB-MFG]  (value not drawn)
R130  ERJ3EKF56R0V  [RESC1608X55X30NL15T15]
R131  ERJ3EKF56R0V  [RESC1608X55X30NL15T15]
R138  ERJ-3EKF1001V  [RESC1608X55X30LL15T15]
R139  ERT-J1VR103J  [RESC1608X90X30ML15T20]
R212  ERJ3EKF1002V  [RESC1609X55X30LL15T15]  (value not drawn)
R213  ERJ-3EKF1001V  [RESC1608X55X30LL15T15]
U16  ADC088S022CIMT/NOPB  [MTC16_L]
U17  ADC088S022CIMT/NOPB  [MTC16_L]

### Ports
2V_AUX_I_SENSE (in, see VISION_BETA_EBB[4B], PWR_MGMT[6A]), 2V_AUX_TEMP (in, see VISION_BETA_EBB[4B]), 2V_AUX_V_SENSE (in, see VISION_BETA_EBB[4B]), 3V3_AUX_I_SENSE (in, see VISION_BETA_EBB[4B], PWR_MGMT[6A]), 3V3_AUX_TEMP (in, see VISION_BETA_EBB[4B]), 3V3_AUX_V_SENSE (in, see VISION_BETA_EBB[4B]), 5V_AUX_TEMP (in, see VISION_BETA_EBB[4A]), 5V_AUX_V_SENSE (in, see VISION_BETA_EBB[4A]), 5V_MAIN_I_SENSE (in, see VISION_BETA_EBB[4B], PWR_MGMT[6A]), 5V_MAIN_TEMP (in, see VISION_BETA_EBB[4A]), 5V_MAIN_V_SENSE (in, see VISION_BETA_EBB[4A]), ADC_MISO (out, see VISION_BETA_EBB[5A]), ADC_MOSI (in, see VISION_BETA_EBB[5A]), ADC_nCS_1 (in, see VISION_BETA_EBB[5A]), ADC_nCS_2 (in, see VISION_BETA_EBB[5A]), ADC_SCLK (in, see VISION_BETA_EBB[5A]), CAN_PWR_TAP (in, see VISION_BETA_EBB[4B]), INT_VCC_I_SENSE (in, see VISION_BETA_EBB[4B], PWR_MGMT[6A]), PRE_VCC_SENSE (in, see VISION_BETA_EBB[4B], PWR_MGMT[6A]), VCC_SENSE (in, see VISION_BETA_EBB[4B], PWR_MGMT[6A])

### Nets
3V3_AUX: C163.1 C166.1 R130.1 R131.1 R138.2 U16.2(VA) U17.2(VA)  [project net 3V3_AUX_FB]
GND: C163.2 C164.2 C165.2 C166.2 C167.2 C168.2 R139.1 R213.1 U16.3(AGND) U16.12(DGND) U17.3(AGND) U17.12(DGND)
2V_AUX_I_SENSE: U16.4(IN0) ; port 2V_AUX_I_SENSE
2V_AUX_TEMP: U16.10(IN6) ; port 2V_AUX_TEMP
2V_AUX_V_SENSE: U16.11(IN7) ; port 2V_AUX_V_SENSE
3V3_AUX_I_SENSE: U16.5(IN1) ; port 3V3_AUX_I_SENSE
3V3_AUX_TEMP: U16.9(IN5) ; port 3V3_AUX_TEMP
3V3_AUX_V_SENSE: U17.11(IN7) ; port 3V3_AUX_V_SENSE
5V_AUX_TEMP: U17.10(IN6) ; port 5V_AUX_TEMP
5V_AUX_V_SENSE: U17.9(IN5) ; port 5V_AUX_V_SENSE
5V_MAIN_I_SENSE: U16.6(IN2) ; port 5V_MAIN_I_SENSE
5V_MAIN_TEMP: U17.8(IN4) ; port 5V_MAIN_TEMP
5V_MAIN_V_SENSE: U17.7(IN3) ; port 5V_MAIN_V_SENSE
ADC_MISO: U16.15(DOUT) U17.15(DOUT) ; port ADC_MISO
ADC_MOSI: U16.14(DIN) U17.14(DIN) ; port ADC_MOSI
ADC_nCS_1: U16.1(~{CS}) ; port ADC_nCS_1
ADC_nCS_2: U17.1(~{CS}) ; port ADC_nCS_2
ADC_SCLK: U16.16(SCLK) U17.16(SCLK) ; port ADC_SCLK
AMBIENT_TEMP: R138.1 R139.2 U16.8(IN4)
CAN_PWR_TAP: R212.2 ; port CAN_PWR_TAP  [project net CAN_PWR]
CAN_PWR_V_SENSE: R212.1 R213.2 U17.6(IN2)
INT_VCC_I_SENSE: U16.7(IN3) ; port INT_VCC_I_SENSE
PRE_VCC_SENSE: U17.4(IN0) ; port PRE_VCC_SENSE
VCC_SENSE: U17.5(IN1) ; port VCC_SENSE
NetC164_1: C164.1 C165.1 R130.2 U16.13(VD)
NetC167_1: C167.1 C168.1 R131.2 U17.13(VD)

### Notes on the sheet
- UNLABELLED RESISTORS ARE 10K

### Library data of the parts
C163-C168 = CMP-2008-02046-2: CAP CER 0.1UF 10V X5R 0402; Manufacturer: Kemet; Material: Ceramic; Capacitance: 0.10 μF; Temperature Coefficient: 15%; Tolerance: 0.1; Value: 0.10 μF; Package: C0402-BB; Temperature: -55°C to +125°C; ComponentLink2Description: Datasheet; Temperature Characteristic: X5R; Device Class L1: Passive Components; Height: 0.55mm; Lead Free: Yes; ComponentLink2URL: https://content.kemet.com/datasheets/KEM_C1002_X7R_SMD.pdf; Device Class L2: Capacitors; Temperature Range Low: -55°C; Temperature Range High: +125°C; RoHS: TRUE; Octopart: https://octopart.com/c0402c104k8pactu-kemet-140039; Automotive: No; Mouser Description: Capacitor 100 nF 10 VDC 0402; Category: Cap; Voltage Rating: 10 V; Digikey Description: CAP CER 0.1UF 10V X5R 0402; Ipc Land Pattern Name: CAPC10050X50; Device Class L3: Ceramic Capacitors; Manufacturer Part Number: C0402C104K8PACTU
R130 R131 = CMP-2000-00572-1: Manufacturer: Panasonic; Part Number: ERJ3EKF56R0V
R138 R213 = CMP-2000-00180-1: Manufacturer: Panasonic; Part Number: ERJ-3EKF1001V
R139 = CMP-2000-00869-1: Manufacturer: Panasonic; Part Number: ERT-J1VR103J
R212 = CMP-1012-00623-3: as R129 on sheet 5V_REG; Number of Pins: 2; Package Reference: 603; Depth: 0.8mm; Mount: SurfaceMount; Package Description: 2-Pin Surface Mount Device, Body 1.6 x 0.85 mm; Datasheet Version: 02/2017; Length: 1.6mm; Lead Free: LeadFree; Height: 0.45mm; Number of Terminations: 2; Max Power Dissipation: 100mW; Min Operating Temperature: -55degC; Datasheet URL: https://industrial.panasonic.com/cdbs/www-data/pdf/RDA0000/AOA0000C304.pdf; Termination: SMD/SMT; Case Code (Metric): 1608; Case Code (Imperial): 0603; Tolerance: 1%; Max Operating Temperature: 155degC; RoHSCompliant: true; Voltage Rating (DC): 75V; Radiation Hardening: No; Packaging: TapeandReel; Composition: ThickFilm; Mounting Technology: SurfaceMount; Manufacturer URL: http://www.panasonic.com/; Width: 0.031inch; REACH SVHC: NoSVHC; Contact Plating: Tin; Military Standard: Not; Package Quantity: 1
U16 U17 = CMP-0054-00372-2: 8-Channel, 50 kSPS to 200 kSPS, 8-Bit A/D Converter, 16-pin TSSOP, Pb-Free; Manufacturer: National Semiconductor; PackageTopMarking: NSUZXYTT*88S022*CIMT; CompType: ADC IC; PowerWise: Y; ComponentLink2URL: http://www.national.com/pf/AD/ADC088S022.html; RoHS: Y; PackageDescription: Molded TSSOP, Jedec, 5 x 4.4 x 0.9mm Body, 16 Lead, 0.65mm Pitch; DatasheetVersion: Feb-2010; PinCount: 16; ComponentLink1Description: ADC088S022 Datasheet; Code_JEDEC: MO-153-AB; ComponentLink3URL: http://www.national.com/packaging/folders/mtc16.html; PackageVersion: revD, Jun-2003; ComponentLink3Description: MTC16 Package Page; RevisionNote: Component URLs added; ComponentLink1URL: http://www.national.com/ds/AD/ADC088S022.pdf; ComponentLink2Description: ADC088S022 Web Page; PackageReference: MTC16